# EAGLE design arduino (EAGLE 7.1.0)
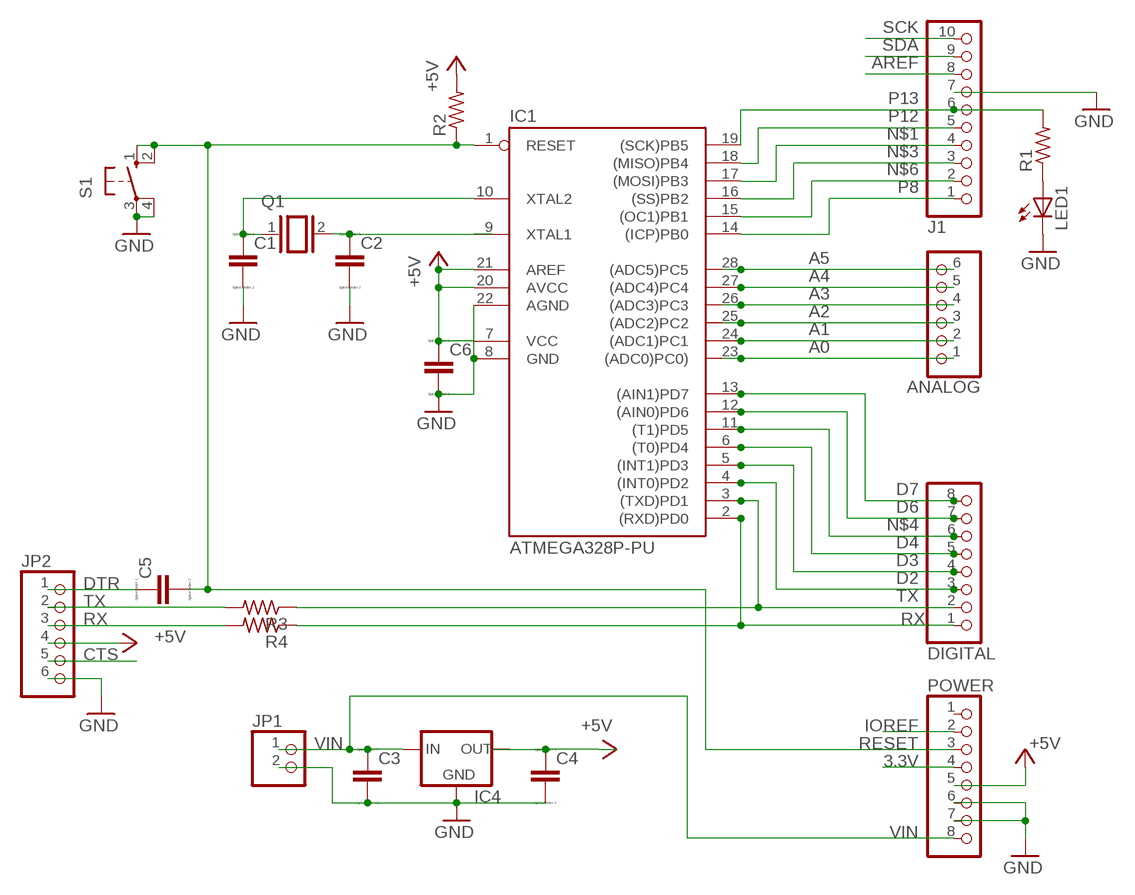
[diagram p0: schematic, sheet 1]

## Parts
ANALOG  PINHD-1X6  [1X06]
C1  C-EU050-025X075  [C050-025X075]
C2  C-EU050-025X075  [C050-025X075]
C3  C-EU050-025X075  [C050-025X075]
C4  C-EU050-025X075  [C050-025X075]
C5  C-EU050-025X075  [C050-025X075]
C6  C-EU050-025X075  [C050-025X075]
DIGITAL  PINHD-1X8TH  [1X08-TH]
IC1  ATMEGA328P-PU  [DIL28-3]
IC4  78XXS  [78XXS]
J1  PINHD-1X10TH  [1X10-TH]
JP1  PINHD-1X2  [1X02]
JP2  PINHD-1X6  [1X06]
LED1  LED3MM  [LED3MM]
POWER  PINHD-1X8TH  [1X08-TH]
Q1  XTAL/S  [QS]
R1  R-US_0207/10  [0207/10]
R2  R-US_0207/10  [0207/10]
R3  R-US_0207/10  [0207/10]
R4  R-US_0207/10  [0207/10]
S1  10-XX  [B3F-10XX]

## Nets
3.3V: POWER.4
A0: ANALOG.1 IC1.23((ADC0)PC0))
A1: ANALOG.2 IC1.24((ADC1)PC1)
A2: ANALOG.3 IC1.25((ADC2)PC2)
A3: ANALOG.4 IC1.26((ADC3)PC3)
A4: ANALOG.5 IC1.27((ADC4)PC4)
A5: ANALOG.6 IC1.28((ADC5)PC5)
AREF: J1.8
CTS: JP2.5
D2: DIGITAL.3 IC1.4((INT0)PD2)
D3: DIGITAL.4 IC1.5((INT1)PD3)
D4: DIGITAL.5 IC1.6((T0)PD4)
D6: DIGITAL.7 IC1.12((AIN0)PD6)
D7: DIGITAL.8 IC1.13((AIN1)PD7)
DTR: C5.1 JP2.1
IOREF: POWER.2
N$1: IC1.17((MOSI)PB3) J1.4
N$2: JP2.2 R3.2
N$3: IC1.16((SS)PB2) J1.3
N$4: DIGITAL.6 IC1.11((T1)PD5)
N$5: C4.1 C6.1 IC1.7(VCC) IC1.20(AVCC) IC1.21(AREF) IC4.OUT JP2.4 POWER.5 R2.2 ; supply symbol labelled +5V
N$6: IC1.15((OC1)PB1) J1.2
N$7: JP2.3 R4.2
N$9: C2.1 IC1.9(XTAL1) Q1.2
N$10: C1.1 IC1.10(XTAL2) Q1.1
N$11: LED1.A R1.1
N$13: C1.2 C2.2 C3.2 C4.2 C6.2 IC1.8(GND) IC1.22(AGND) IC4.GND J1.7 JP1.2 JP2.6 LED1.K(C) POWER.6 POWER.7 S1.3(P) S1.4(P1) ; supply symbol labelled GND
P8: IC1.14((ICP)PB0) J1.1
P12: IC1.18((MISO)PB4) J1.5
P13: IC1.19((SCK)PB5) J1.6 R1.2
RESET: C5.2 IC1.1(RESET) POWER.3 R2.1 S1.1(S) S1.2(S1)
RX: DIGITAL.1 IC1.2((RXD)PD0) R4.1
SCK: J1.10
SDA: J1.9
TX: DIGITAL.2 IC1.3((TXD)PD1) R3.1
VIN: C3.1 IC4.IN JP1.1 POWER.8
Unconnected: POWER.1

## Library data of the parts
ANALOG JP2 = pinhead:PINHD-1X6: PIN HEADER
C1-C6 = resistor:C-EU: CAPACITOR, European symbol; SPICEPREFIX: C
DIGITAL POWER = SmartPrj:PINHD-1X8: PIN HEADER
IC1 = SmartPrj:ATMEGA328P-: MICROCONTROLLER 4 Kbytes FLASH 128 bytes SRAM 256 bytes EEPROM UART 6-channel 10 bit ADC
IC4 = v-reg:78XXS: VOLTAGE REGULATOR
J1 = SmartPrj:PINHD-1X10: PIN HEADER
JP1 = pinhead:PINHD-1X2: PIN HEADER
LED1 = led:LED: LED OSRAM: - CHIPLED LG R971, LG N971, LY N971, LG Q971, LY Q971, LO R971, LY R971 LH N974, LH R974 LS Q976, LO Q976, LY Q976 LO Q996 - Hyper CHIPLED LW Q18S LB Q993, LB Q99A, LB R99A - SideLED LS A670, LO A670, LY A670, LG A670, LP A670 LB A673, LV A673, LT A673, LW A673 LH A674 LY A675 LS A676, LA A676, LO A676, LY A676, LW A676 LS A679, LY A679, LG A679 - Hyper Micro SIDELED® LS Y876, LA Y876, LO Y876, LY Y876 LT Y87S - SmartLED LW L88C, LW L88S LB L89C, LB L89S, LG L890 LS L89K, LO L89K, LY L89K LS L896, LA L896, LO L896, LY L896 - TOPLED LS T670, LO T670, LY T670, LG T670, LP T670 LSG T670, LSP T670, LSY T670, LOP T670, LYG T670 LG T671, LOG T671, LSG T671 LB T673, LV T673, LT T673, LW T673 LH T674 LS T676, LA T676, LO T676, LY T676, LB T676, LH T676, LSB T676, LW T676 LB T67C, LV T67C, LT T67C, LS T67K, LO T67K, LY T67K, LW E67C LS E67B, LA E67B, LO E67B, LY E67B, LB E67C, LV E67C, LT E67C LW T67C LS T679, LY T679, LG T679 LS T770, LO T770, LY T770, LG T770, LP T770 LB T773, LV T773, LT T773, LW T773 LH T774 LS E675, LA E675, LY E675, LS T675 LS T776, LA T776, LO T776, LY T776, LB T776 LHGB T686 LT T68C, LB T68C - Hyper Mini TOPLED® LB M676 - Mini TOPLED Santana® LG M470 LS M47K, LO M47K, LY M47K Source: http://www.osram.convergy.de LUXEON: - LUMILED® LXK2-PW12-R00, LXK2-PW12-S00, LXK2-PW14-U00, LXK2-PW14-V00 LXK2-PM12-R00, LXK2-PM12-S00, LXK2-PM14-U00 LXK2-PE12-Q00, LXK2-PE12-R00, LXK2-PE12-S00, LXK2-PE14-T00, LXK2-PE14-U00 LXK2-PB12-K00, LXK2-PB12-L00, LXK2-PB12-M00, LXK2-PB14-N00, LXK2-PB14-P00, LXK2-PB14-Q00 LXK2-PR12-L00, LXK2-PR12-M00, LXK2-PR14-Q00, LXK2-PR14-R00 LXK2-PD12-Q00, LXK2-PD12-R00, LXK2-PD12-S00 LXK2-PH12-R00, LXK2-PH12-S00 LXK2-PL12-P00, LXK2-PL12-Q00, LXK2-PL12-R00 Source: www.luxeon.com KINGBRIGHT: KA-3528ASYC Source: www.kingbright.com
Q1 = SmartPrj:XTAL/S: CRYSTAL
R1-R4 = resistor:R-US_: RESISTOR, American symbol
S1 = switch-omron:10-XX: OMRON SWITCH; MPN: B3F-1000; OC_FARNELL: 176432; OC_NEWARK: 36M3542

## Net classes
0 default: clearance 0.205 mm

## Board
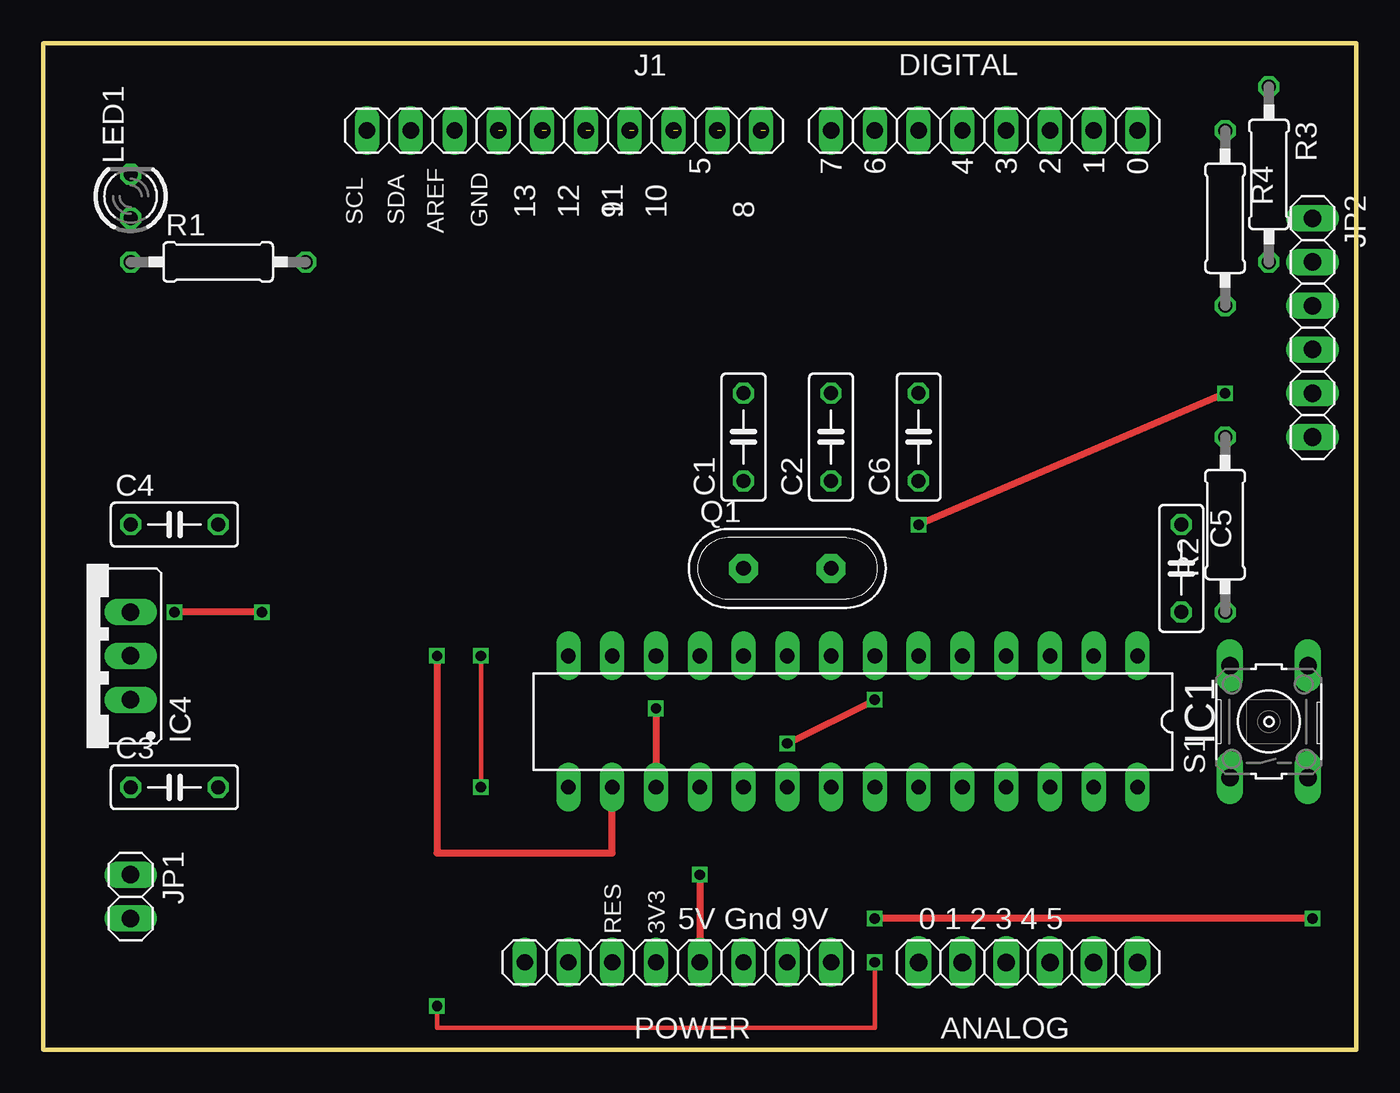
[diagram p1: board, top side]
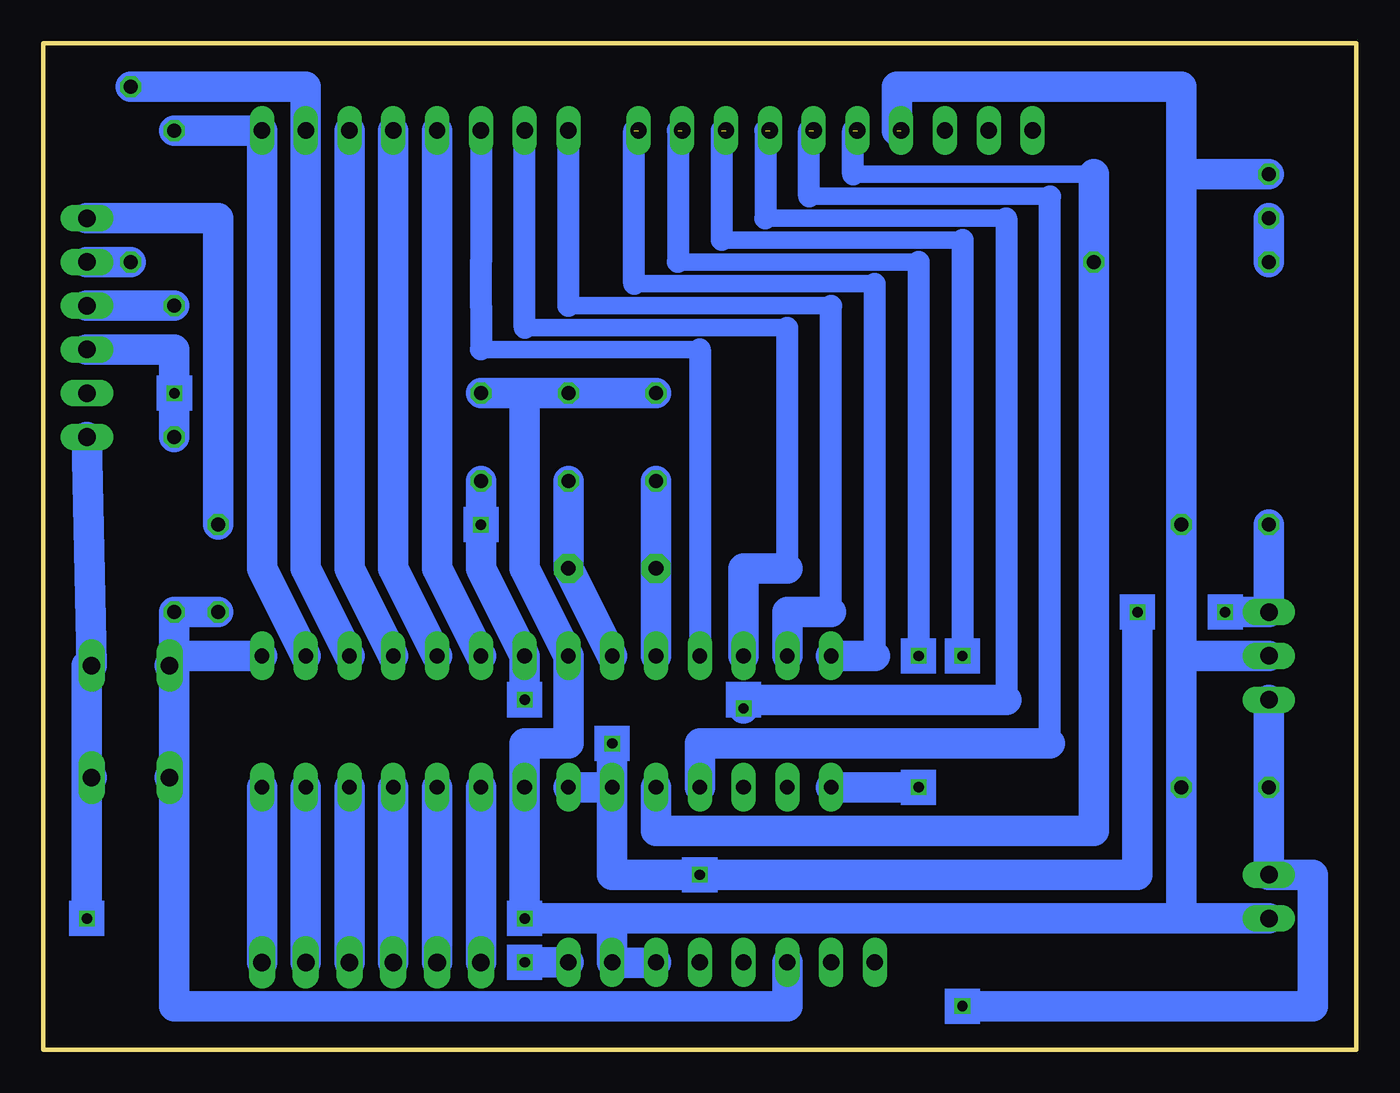
[diagram p2: board, bottom side, seen from below]

Size 76.2 x 58.42 mm. Coordinates in mm from the lower left corner, seen from the top.
Outline: 0,58.42 76.2,58.42 76.2,0 0,0 0,58.42
Copper layers (1*16): Top 0.035mm / dielectric 1.53mm / Bottom 0.035mm
Design rules "pban_4mil-l2": minimum track width 0.1mm, minimum drill 0.3mm, track to track 0.1mm, track to pad 0.229mm, pad to pad 0.1mm, via to via 0.1mm, smd to smd 0.1mm, copper to edge 0.5mm, drill to drill 0.5mm, minimum pad ring 0.15mm, minimum via ring 0.15mm, stop-mask expansion 4mil, vias tented up to drill 0.35mm, thermal gap 10mil

### Footprints (pad centres in the part's own frame; a part is rotated, then mirrored left to right if it is on the bottom)
1X06 = drill 1.016 long: 1 -6.35,0; 2 -3.81,0; 3 -1.27,0; 4 1.27,0; 5 3.81,0; 6 6.35,0
C050-025X075 = drill 0.813 octagon: 1 -2.54,0; 2 2.54,0
1X08-TH = drill 0.95 pad 1.422 long: 1 -8.89,0; 2 -6.35,0; 3 -3.81,0; 4 -1.27,0; 5 1.27,0; 6 3.81,0; 7 6.35,0; 8 8.89,0
DIL28-3 = drill 0.85 pad 1.422 long: 1 -16.51,-3.81; 2 -13.97,-3.81; 3 -11.43,-3.81; 4 -8.89,-3.81; 5 -6.35,-3.81; 6 -3.81,-3.81; 7 -1.27,-3.81; 8 1.27,-3.81; 9 3.81,-3.81; 10 6.35,-3.81; 11 8.89,-3.81; 12 11.43,-3.81; 13 13.97,-3.81; 14 16.51,-3.81; 15 16.51,3.81; 16 13.97,3.81; 17 11.43,3.81; 18 8.89,3.81; 19 6.35,3.81; 20 3.81,3.81; 21 1.27,3.81; 22 -1.27,3.81; 23 -3.81,3.81; 24 -6.35,3.81; 25 -8.89,3.81; 26 -11.43,3.81; 27 -13.97,3.81; 28 -16.51,3.81
78XXS = drill 1.016 long: GND 0,-2.54; IN -2.54,-2.54; OUT 2.54,-2.54
1X10-TH = drill 0.95 pad 1.422 long: 1 -11.43,0; 2 -8.89,0; 3 -6.35,0; 4 -3.81,0; 5 -1.27,0; 6 1.27,0; 7 3.81,0; 8 6.35,0; 9 8.89,0; 10 11.43,0
1X02 = drill 1.016 long: 1 -1.27,0; 2 1.27,0
LED3MM = drill 0.813 octagon: A -1.27,0; K 1.27,0
QS = drill 0.85 pad 1.676 octagon: 1 -2.54,0; 2 2.54,0
0207/10 = drill 0.813 octagon: 1 -5.08,0; 2 5.08,0
B3F-10XX = drill 1.016 long: 1 -3.251,2.261; 2 3.251,2.261; 3 -3.251,-2.261; 4 3.251,-2.261

### Placement (x,y rotation side)
ANALOG  57.15,5.08 0 top
C1  40.64,35.56 90 top
C2  45.72,35.56 90 top
C3  7.62,15.24 0 top
C4  7.62,30.48 0 top
C5  66.04,27.94 270 top
C6  50.8,35.56 90 top
DIGITAL  54.61,53.34 180 top
IC1  46.99,19.05 180 top
IC4  2.54,22.86 90 top
J1  30.23,53.34 180 top
JP1  5.08,8.89 270 top
JP2  73.66,41.91 270 top
LED1  5.08,49.53 90 top
POWER  36.83,5.08 0 top
Q1  43.18,27.94 0 top
R1  10.16,45.72 0 top
R2  68.58,30.48 90 top
R3  71.12,50.8 270 top
R4  68.58,48.26 270 top
S1  71.12,19.05 90 top

### Tracks (layer width: path | path; a pad name or v marks a point on that pad's centre or on a via)
A0
  Bottom 1.778: IC1.23 ANALOG.1
A1
  Bottom 1.778: IC1.24 ANALOG.2
A2
  Bottom 1.778: IC1.25 ANALOG.3
A3
  Bottom 1.778: IC1.26 ANALOG.4
A4
  Bottom 1.778: IC1.27 ANALOG.5
A5
  Bottom 1.778: IC1.28 ANALOG.6
D2
  Bottom 1.778: DIGITAL.3 58.42,27.94 IC1.4
D3
  Bottom 1.778: DIGITAL.4 55.88,27.94 IC1.5
D4
  Bottom 1.778: DIGITAL.5 53.34,27.94 IC1.6
D6
  Bottom 1.016: 33.02,41.91 48.26,41.91
  Bottom 1.27: 33.02,27.94 33.02,41.91 | 48.26,41.91 DIGITAL.7
  Bottom 1.778: IC1.12 35.56,27.94 33.02,27.94
D7
  Bottom 1.016: 30.48,43.18 45.72,43.18
  Bottom 1.27: 30.48,25.4 30.48,43.18 | 45.72,43.18 DIGITAL.8
  Bottom 1.778: IC1.13 33.02,25.4 30.48,25.4
DTR
  Bottom 1.778: C5.1 66.04,48.26 JP2.1
N$1  (via drill 0.6)  (1 unrouted)
  Top 0.406: v35.56,19.81 IC1.17
  Bottom 1.016: 34.29,48.26 20.32,48.26
  Bottom 1.27: 34.29,53.34 34.29,48.26 | 20.32,48.26 20.32,20.32
  Bottom 1.778: 20.32,20.32 35.56,20.32 v35.56,19.81
N$2
  Bottom 1.778: R3.2 JP2.2
N$3  (via drill 0.6)  (1 unrouted)
  Top 0.406: v22.86,22.86 22.86,11.43 33.02,11.43 IC1.16
  Bottom 1.016: 36.83,46.99 22.86,46.99
  Bottom 1.27: 36.83,53.34 36.83,46.99 | 22.86,46.99 v22.86,22.86
N$4
  Bottom 1.016: 50.8,40.64 38.1,40.64
  Bottom 1.27: DIGITAL.6 50.8,45.72 50.8,43.18 50.8,40.64 | 38.1,40.64 IC1.11
N$5  (via drill 0.6)
  Top 0.406: v12.7,25.4 v7.62,25.4 | v43.18,17.78 v48.26,20.32 | v38.1,10.16 POWER.5 | v68.58,38.1 v50.8,30.48
  Bottom 1.778: IC1.20 43.18,10.16 v38.1,10.16 12.7,10.16 v12.7,25.4 | C4.1 IC4.OUT v7.62,25.4 | IC1.20 IC1.21 | IC1.20 v43.18,17.78 | v48.26,20.32 IC1.7 50.8,27.94 v50.8,30.48 C6.1 | JP2.4 68.58,40.64 v68.58,38.1 R2.2
N$6  (via drill 0.6)  (1 unrouted)
  Top 0.254: v25.4,22.86 v25.4,15.24
  Bottom 1.016: 39.37,45.72 25.4,45.72
  Bottom 1.27: 39.37,53.34 39.37,45.72 | 25.4,45.72 v25.4,22.86
  Bottom 1.778: v25.4,15.24 IC1.15
N$7
  Bottom 1.778: JP2.3 R4.2
N$9
  Bottom 1.778: IC1.9 Q1.2 C2.1
N$10
  Bottom 1.778: C1.1 Q1.1 IC1.10
N$11
  Bottom 1.778: R1.1 LED1.A
N$13  (via drill 0.6)  (1 unrouted)
  Top 0.406: v73.66,7.62 v48.26,7.62
  Bottom 1.778: POWER.6 40.7,5.04 43.1,5.04 POWER.7 43.18,7.62 | IC4.GND 10.16,22.86 | 10.16,22.86 C3.2 10.16,7.62 | 10.16,22.86 C4.2 10.16,50.8 | C1.2 C2.2 48.26,38.1 | C6.2 48.26,38.1 | LED1.K 10.16,50.8 | 10.16,50.8 10.16,55.88 26.67,55.88 26.67,53.34 | 43.18,7.62 v48.26,7.62 IC1.22 48.26,17.78 45.72,17.78 IC1.8 48.26,27.94 48.26,38.1 | 43.18,7.62 10.16,7.62 | JP1.2 10.16,7.62 | S1.3 73.66,15.8 | 73.66,15.8 v73.66,7.62 | 73.66,15.8 73.66,22.3 S1.4 JP2.6
P8  (1 unrouted)
  Bottom 1.016: 27.94,44.45 41.91,44.45
  Bottom 1.27: 27.94,22.86 27.94,44.45 | 41.91,44.45 41.91,53.34
  Bottom 1.778: IC1.14 27.94,22.86
P12  (1 unrouted)
  Bottom 1.016: 17.78,49.53 31.75,49.53
  Bottom 1.27: 17.78,17.78 17.78,49.53 | 31.75,49.53 31.75,53.34
  Bottom 1.778: IC1.18 38.1,17.78 17.78,17.78
P13  (1 unrouted)
  Bottom 1.016: 15.24,50.8 29.21,50.8
  Bottom 1.27: 29.21,50.8 29.21,53.34
  Bottom 1.778: IC1.19 40.64,12.7 15.24,12.7 R1.2 15.24,50.8
RESET
  Bottom 1.778: POWER.3 33.02,2.54 68.58,2.54 68.58,15.24 | 68.58,15.24 S1.1 | 68.58,22.86 68.58,15.24 | 68.58,22.86 IC1.1 | 68.58,22.86 S1.2 | C5.2 R2.1 68.58,22.86
RX
  Bottom 1.778: IC1.2 63.5,27.94 DIGITAL.1 R4.1
TX
  Bottom 1.778: IC1.3 60.96,27.94 DIGITAL.2 60.96,55.88 R3.1
VIN  (via drill 0.6)
  Top 0.254: v48.26,5.08 48.26,1.27 22.86,1.27 v22.86,2.54
  Bottom 1.778: C3.1 IC4.IN JP1.1 2.54,10.16 2.54,2.54 v22.86,2.54 | POWER.8 v48.26,5.08
(copper drawn outside any net)
  shapes: Bottom area x15

### Text on the board
tPlace: 5 | 7 | 6 | 4 | 3 | 2 | 1 | 0 | 13 | 12 | 11 | 9 | 10 | 8
tNames: AREF | SCL | SDA | GND | RES | 3V3 | 5V Gnd 9V | 0 1 2 3 4 5
bStop: 7 | 6 | 5 | 4 | 3 | 2 | 1 | 0 | 13 | 12 | 11 | 10 | SCL | SDA | AREF | GND | 9 | 8 | IOREF | RST | 3.3V | 5V | GND | GND | VIN | 0 | 1 | 2 | 3 | 4 | 5